# Altium schematic sheet FE_LDOs.SchDoc: FMC SDR Frontend
size 420 x 297 mm; EDA_Number: EDA-XXXXX-VX-X; Projet: -; ModifiedBy: -; CreateDate: XX/XX/XXXX; CheckedDate: -; Title2: Power Supply LDOs; DivGrp: TE/MPE; Designer: Designer
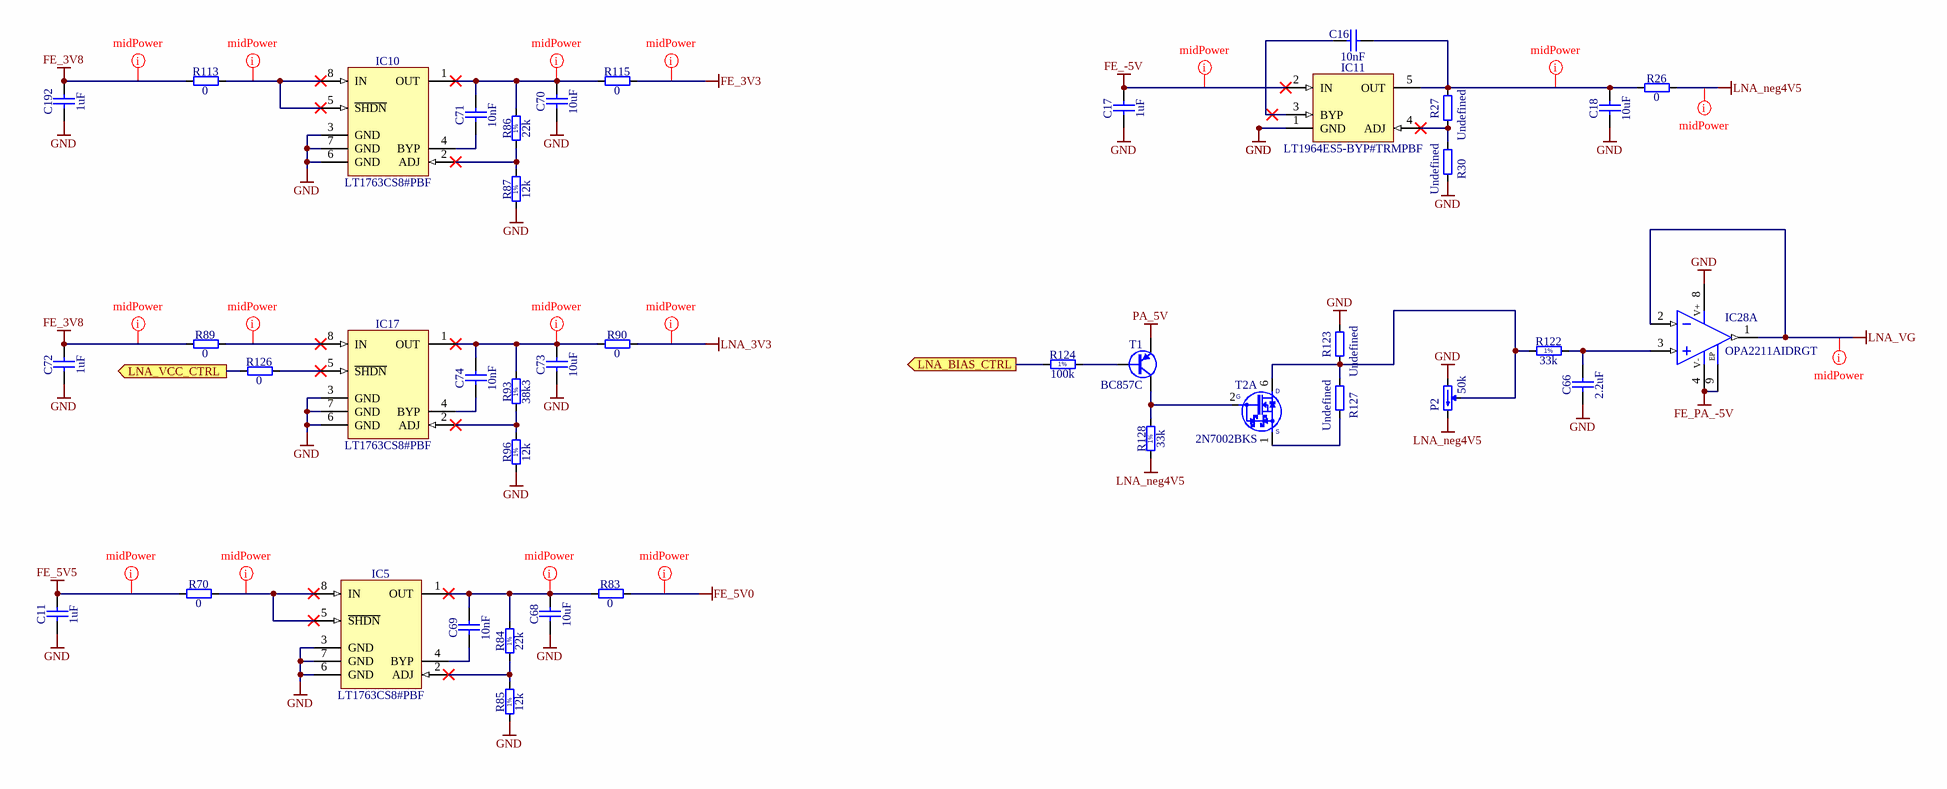
[diagram p0: FE_LDOs.SchDoc]

## Parts
C11  1uF  [CAPC1608X87N]
C16  10nF  [CAPC1608X87N]
C17  1uF  [CAPC1608X87N]
C18  10uF  [CAPC2012X95N]
C66  2.2uF  [CAPC2012X135N]
C68  10uF  [CAPC2012X95N]
C69  10nF  [CAPC1005X55N]
C70  10uF  [CAPC2012X95N]
C71  10nF  [CAPC1005X55N]
C72  1uF  [CAPC1608X87N]
C73  10uF  [CAPC2012X95N]
C74  10nF  [CAPC1005X55N]
C192  1uF  [CAPC1608X87N]
IC5  LT1763CS8#PBF  [SOIC127P600X175-8N]
IC10  LT1763CS8#PBF  [SOIC127P600X175-8N]
IC11  LT1964ES5-BYP#TRMPBF  [SOT95P280X100-5N]
IC17  LT1763CS8#PBF  [SOIC127P600X175-8N]
IC28  OPA2211AIDRGT  [SON50P300X300X80-9N-R155X250]  (part A of 2)
P2  50k  [TRIM_BOURNS_3223W]
R26  0  [RESC1608X55N]
R27  Undefined  [RESC1608X55N]
R30  Undefined  [RESC1608X55N]
R70  0  [RESC1608X55N]
R83  0  [RESC1608X55N]
R84  22k  [RESC1005X40N]
R85  12k  [RESC1005X40N]
R86  22k  [RESC1005X40N]
R87  12k  [RESC1005X40N]
R89  0  [RESC1608X55N]
R90  0  [RESC1608X55N]
R93  38k3  [RESC1005X40N]
R96  12k  [RESC1005X40N]
R113  0  [RESC1608X55N]
R115  0  [RESC1608X55N]
R122  33k  [RESC1005X40N]
R123  Undefined  [RESC1608X55N]
R124  100k  [RESC1608X55N]
R126  0  [RESC1608X55N]
R127  Undefined  [RESC1608X55N]
R128  33k  [RESC1608X55N]
T1  BC857C  [SOT95P240X110-3N]
T2  2N7002BKS  [SOT65P210X110-6N]  (part A of 2)

## Ports
LNA_BIAS_CTRL (out), LNA_VCC_CTRL (out)

## Nets
FE_3V3: R115.2
FE_3V8: C72.2 C192.2 R89.1 R113.1
FE_5V0: R83.2
FE_5V5: C11.2 R70.1
FE_-5V: C17.2 IC11.2(IN)
FE_PA_-5V: IC28.4(V-) IC28.9(Exposed_Pad)
GND: C11.1 C17.1 C18.1 C66.1 C68.1 C70.1 C72.1 C73.1 C192.1 IC5.3(GND) IC5.6(GND) IC5.7(GND) IC10.3(GND) IC10.6(GND) IC10.7(GND) IC11.1(GND) IC17.3(GND) IC17.6(GND) IC17.7(GND) IC28.8(V+) P2.1(CCW) R30.1 R85.1 R87.1 R96.1 R123.2
LNA_3V3: R90.2
LNA_neg4V5: P2.3(CW) R26.2 R128.1
LNA_VG: IC28.1(OUT) IC28.2(IN-)
PA_5V: T1.2(E)
LNA_BIAS_CTRL: R124.1 ; port LNA_BIAS_CTRL
LNA_VCC_CTRL: R126.1 ; port LNA_VCC_CTRL
NetC16_1: C16.1 IC11.3(BYP)
NetC16_2: C16.2 C18.2 IC11.5(OUT) R26.1 R27.2
NetC66_2: C66.2 IC28.3(IN+) R122.2
NetC68_2: C68.2 C69.2 IC5.1(OUT) R83.1 R84.2
NetC69_1: C69.1 IC5.4(BYP)
NetC70_2: C70.2 C71.2 IC10.1(OUT) R86.2 R115.1
NetC71_1: C71.1 IC10.4(BYP)
NetC73_2: C73.2 C74.2 IC17.1(OUT) R90.1 R93.2
NetC74_1: C74.1 IC17.4(BYP)
NetIC5_2: IC5.2(ADJ) R84.1 R85.2
NetIC5_5: IC5.5(~{SHDN}) IC5.8(IN) R70.2
NetIC10_2: IC10.2(ADJ) R86.1 R87.2
NetIC10_5: IC10.5(~{SHDN}) IC10.8(IN) R113.2
NetIC11_4: IC11.4(ADJ) R27.1 R30.2
NetIC17_2: IC17.2(ADJ) R93.1 R96.2
NetIC17_5: IC17.5(~{SHDN}) R126.2
NetIC17_8: IC17.8(IN) R89.2
NetP2_2: P2.2(W) R122.1 R123.1 R127.2 T2.6(D)
NetR124_2: R124.2 T1.1(B)
NetR127_1: R127.1 T2.1(S)
NetR128_2: R128.2 T1.3(C) T2.2(G)

## Layout directives
net class midPower: FE_3V3, FE_3V8, FE_5V0, FE_5V5, FE_-5V, LNA_3V3, LNA_neg4V5, LNA_VG, NetC16_2, NetC68_2, NetC70_2, NetC73_2, NetIC5_5, NetIC10_5, NetIC17_8

## Notes on the sheet
- (near R26) Starting from -4.5V
- Project/Equipment
- Document
- Designer
- Drawn by
- Check.by
- File
- Last Mod.
- Print Date
- Sheet
- Size
- A3
- of
- Rev
- (in symbol OPA2211AIDRGT, part A) EP
- (in symbol R0402_12K_1%_0.0625W_100PPM) 1%
- (in symbol R0402_22K_1%_0.0625W_100PPM) 1%
- (in symbol R0402_33K_1%_0.0625W_100PPM) 1%
- (in symbol R0402_38K3_1%_0.0625W_100PPM) 1%
- (in symbol R0603_33K_1%_0.1W_100PPM) 1%
- (in symbol R0603_100K_1%_0.1W_100PPM) 1%

## Library data of the parts
C11 C17 C72 C192 = CC0603_1UF_25V_10%_X7R: Non-polarised capacitor; Part Description: SMD Multilayer Chip Ceramic Capacitor; Manufacturer: GENERIC; Manufacturer1 Part Number: GRM188R71E105KA12D; Voltage: 25V; TC: X7R; Tolerance: ±10%; Part Number: CC0603_1UF_25V_10%_X7R; Component Kind: Standard; Component Type: Standard; Pin Count: 2; Value: 1uF; Status: None; Manufacturer Part Number: CC0603_1UF_25V_10%_X7R; Case: 0603; Mounted: Yes; Socket: No; SMD: Yes; Sense: No; Manufacturer1 Example: MURATA; Manufacturer1 ComponentHeight: 0.9mm; HelpURL: \\cern.ch\dfs\Applications\Altium\Datasheets\CC0603_X7R_MURATA.pdf; Author: CERN DEM JLC; CreateDate: 18/01/2011; LatestRevisionDate: 18/01/2011
C16 = CC0603_10NF_50V_5%_C0G: Non-polarised capacitor; Part Description: SMD Multilayer Chip Ceramic Capacitor; Manufacturer: GENERIC; Manufacturer1 Part Number: C1608C0G1H103J080AA; Voltage: 50V; TC: C0G/NP0; Tolerance: ±5%; Part Number: CC0603_10NF_50V_5%_C0G; Component Kind: Standard; Component Type: Standard; Pin Count: 2; Value: 10nF; Status: Preferred; Manufacturer Part Number: CC0603_10NF_50V_5%_C0G; Case: 0603; Mounted: Yes; Socket: No; SMD: Yes; Sense: No; Manufacturer1 Example: TDK; Manufacturer1 ComponentHeight: 0.9mm; HelpURL: \\cern.ch\dfs\Applications\Altium\Datasheets\CC0603_C0G_TDK_C.pdf; Author: CERN DEM JLC; CreateDate: 10.12.2014; LatestRevisionDate: 10.12.2014
C18 C68 C70 C73 = CC0805_10UF_25V_10%_X5R: Non-polarised capacitor; Part Description: SMD Multilayer Chip Ceramic Capacitor; Manufacturer: GENERIC; Manufacturer1 Part Number: GRM219R61E106KA12D; Voltage: 25V; TC: X5R; Tolerance: ±10%; Part Number: CC0805_10UF_25V_10%_X5R; Component Kind: Standard; Component Type: Standard; Pin Count: 2; Value: 10uF; Status: Preferred; Manufacturer Part Number: CC0805_10UF_25V_10%_X5R; Case: 0805; Mounted: Yes; Socket: No; SMD: Yes; Sense: No; Manufacturer1 Example: MURATA; Manufacturer1 ComponentHeight: 0.95mm; HelpURL: \\cern.ch\dfs\Applications\Altium\Datasheets\CC0805_X5R_MURATA_GRM.pdf; Author: CERN DEM JLC; CreateDate: 25/10/2012; LatestRevisionDate: 06/09/2016
C66 = CC0805_2.2UF_16V_10%_X7R: Non-polarised capacitor; Part Description: SMD Multilayer Chip Ceramic Capacitor; Manufacturer: GENERIC; Manufacturer1 Part Number: GRM21BF51C225ZA01L; Voltage: 16V; TC: X7R; Tolerance: ±10%; Part Number: CC0805_2.2UF_16V_10%_X7R; Component Kind: Standard; Component Type: Standard; Pin Count: 2; Value: 2.2uF; Status: Preferred; Manufacturer Part Number: CC0805_2.2UF_16V_10%_X7R; Case: 0805; Mounted: Yes; Socket: No; SMD: Yes; Sense: No; Manufacturer1 Example: MURATA; Manufacturer1 ComponentHeight: 1.5mm; HelpURL: \\cern.ch\dfs\Applications\Altium\Datasheets\CC0805_X7R_MURATA_GRM.pdf; Author: CERN DEM JLC; CreateDate: 03.12.2007; LatestRevisionDate: 18.09.2014
C69 C71 C74 = CC0402_10NF_50V_10%_X7R: Non-polarised capacitor; Part Description: SMD Multilayer Chip Ceramic Capacitor; Manufacturer: GENERIC; Manufacturer1 Part Number: GRM155R71H103KA88D; Voltage: 50V; TC: X7R; Tolerance: ±10%; Part Number: CC0402_10NF_50V_10%_X7R; Component Kind: Standard; Component Type: Standard; Pin Count: 2; Value: 10nF; Status: None; Manufacturer Part Number: CC0402_10NF_50V_10%_X7R; Case: 0402; Mounted: Yes; Socket: No; SMD: Yes; Sense: No; Manufacturer1 Example: MURATA; Manufacturer1 ComponentHeight: 0.55mm; HelpURL: \\cern.ch\dfs\Applications\Altium\Datasheets\CC0402_X7R_MURATA_GRM.pdf; Author: CERN DEM MR; CreateDate: 08.01.2016; LatestRevisionDate: 08.01.2016
IC5 IC10 IC17 = LT1763CS8#PBF: 1.22V to 20V 500mA, Low Noise, LDO Adjustable Micropower Regulator; Manufacturer: LINEAR TECHNOLOGY; PressFit: No; Bonding: No; Part Number: LT1763CS8#PBF; Component Kind: Standard; Component Type: Standard; Device: LT1763CS8#PBF; PackageDescription: SOIC 8, Pitch 1.27mm, Body 4x5mm, IPC Medium Density; Part Description: 1.22V to 20V 500mA, Low Noise, LDO Adjustable Micropower Regulator; Manufacturer Part Number: LT1763CS8#PBF; Pin Count: 8; Case: SOIC8; Mounted: Yes; Socket: No; SMD: Yes; Sense: No; ComponentHeight: 1.75mm; HelpURL: \\cern.ch\dfs\Applications\Altium\Datasheets\LT1763CS8#PBF.pdf; Author: CERN DEM JLC; CreateDate: 11.01.2010; LatestRevisionDate: 11.01.2010
IC11 = LT1964ES5-BYP#TRMPBF: 200mA, Low Noise, Low Dropout Negative Micropower Regulator; Part Description: -1.22V to -20V, 200mA, Low Noise, Low Dropout Negative Micropower Regulator; Manufacturer: LINEAR TECHNOLOGY; PressFit: No; Bonding: No; Part Number: LT1964ES5-BYP#TRMPBF; Component Kind: Standard; Component Type: Standard; Device: LT1964ES5-BYP#TRMPBF; PackageDescription: SOT23, 0.95mm pitch; 5 pin, 1.75mm W X 3.00mm L, IPC Medium Density; Manufacturer Part Number: LT1964ES5-BYP#TRMPBF; Pin Count: 5; Case: SOT23-5; Mounted: Yes; Socket: No; SMD: Yes; Sense: No; ComponentHeight: 1mm; HelpURL: \\cern.ch\dfs\Applications\Altium\Datasheets\LT1964ES5-BYP#TRMPBF.pdf; Author: CERN DEM MR; CreateDate: 17.02.2016; LatestRevisionDate: 17.02.2016
IC28 = OPA2211AIDRGT: Dual Operational Amplifier With Exposed Pad; Part Description: 1.1nV/sqrt Hz Noise, Low Power, PrecisionOperational Amplifier; Manufacturer: TEXAS INSTRUMENTS; PressFit: No; Bonding: No; Part Number: OPA2211AIDRGT; Component Kind: Standard; Component Type: Standard; Device: OPA2211AIDRGT; PackageDescription: SON,  0.50mm Pitch, 8 Pin, 3mm X 3mm X 0.8mm H Body (w/Thermal Tab 1.55 X 2.5mm),  IPC Medium Density; Manufacturer Part Number: OPA2211AIDRGT; Pin Count: 9; Case: SON8; Mounted: Yes; Socket: No; SMD: Yes; Sense: No; ComponentHeight: 0.8mm; Author: CERN DEM JLC; HelpURL: \\cern.ch\dfs\Applications\Altium\Datasheets\OPA2211AIDRGT.pdf; CreateDate: 17.11.2014; LatestRevisionDate: 17.11.2014
P2 = TRIM_11T_50K_BOURNS_3223W-1-503E: Trimming Potentiometer; Part Description: 11 Turns SMD Trimpot® Trimming Potentiometer (Top Adjust); Manufacturer: BOURNS; Power: 0.125W; TC: ±100ppm/°C; Tolerance: ±20%; PressFit: No; Part Number: TRIM_11T_50K_BOURNS_3223W-1-503E; Component Kind: Standard; Component Type: Standard; Pin Count: 3; Value: 50k; Manufacturer Part Number: 3223W-1-503E; Case: 3223W; Mounted: Yes; Socket: No; SMD: Yes; Sense: No; ComponentHeight: 4.16mm; HelpURL: \\cern.ch\dfs\Applications\Altium\Datasheets\TRIM_BOURNS_3223W.pdf; Author: CERN DEM JLC; CreateDate: 31.03.2011; LatestRevisionDate: 18.12.2012
R26 R70 R83 R89 R90 R113 R115 R126 = R0603_0R_JUMPER: Resistor; Part Description: 1A (0.05R Max DC Resistance) Zero Ohm Jumper; Manufacturer: GENERIC; Manufacturer1 Part Number: NRC06Z0; PressFit: No; Part Number: R0603_0R_JUMPER; Component Kind: Standard; Component Type: Standard; Pin Count: 2; Value: 0; Status: Preferred; Manufacturer Part Number: R0603_0R_JUMPER; Case: 0603; Mounted: Yes; Sense: No; Socket: No; SMD: Yes; Manufacturer1 Example: NIC COMPONENT; Manufacturer1 ComponentHeight: 0.55mm; HelpURL: \\cern.ch\dfs\Applications\Altium\Datasheets\R0603_NIC_NRC.pdf; Author: CERN DEM JLC; CreateDate: 03.12.2007; LatestRevisionDate: 13.03.2008
R27 R30 R123 R127 = R0603_NO-VALUE: Resistor; Part Description: Reserved Footprint For a 0603 (1608) Chip Resistor; PressFit: No; Mounted: No; Part Number: R0603_NO-VALUE; Component Kind: Standard; Component Type: Standard; Pin Count: 2; Value: Undefined; Status: None; Manufacturer: Undefined; Manufacturer Part Number: R0603_NO-VALUE; Case: 0603; Sense: No; Socket: No; SMD: Yes; Manufacturer1 Example: Undefined; Manufacturer1 Part Number: Undefined; Manufacturer1 ComponentHeight: Undefined; HelpURL: Undefined; Author: CERN DEM JLC; CreateDate: 03.12.2007; LatestRevisionDate: 13.03.2008
R84 R86 = R0402_22K_1%_0.0625W_100PPM: Resistor - 1%; Part Description: General Purpose Thick Film Chip Resistor; Manufacturer: GENERIC; Manufacturer1 Part Number: 232270672203L; TC: ±100ppm/°C; PressFit: No; Part Number: R0402_22K_1%_0.0625W_100PPM; Component Kind: Standard; Component Type: Standard; Pin Count: 2; Value: 22k; Status: Not Recommended; Power: 0.0625W; Tolerance: ±1%; Manufacturer Part Number: R0402_22K_1%_0.0625W_100PPM; Case: 0402; Mounted: Yes; Sense: No; Socket: No; SMD: Yes; Manufacturer1 Example: YAGEO PHYCOMP; Manufacturer1 ComponentHeight: 0.4mm; HelpURL: \\cern.ch\dfs\Applications\Altium\Datasheets\R0402_Phycomp_RC0402.pdf; Author: CERN DEM JLC; CreateDate: 03.12.2007; LatestRevisionDate: 17.10.2012
R85 R87 R96 = R0402_12K_1%_0.0625W_100PPM: Resistor - 1%; Part Description: General Purpose Thick Film Chip Resistor; Manufacturer: GENERIC; Manufacturer1 Part Number: 232270671203L; TC: ±100ppm/°C; PressFit: No; Part Number: R0402_12K_1%_0.0625W_100PPM; Component Kind: Standard; Component Type: Standard; Pin Count: 2; Value: 12k; Status: Not Recommended; Power: 0.0625W; Tolerance: ±1%; Manufacturer Part Number: R0402_12K_1%_0.0625W_100PPM; Case: 0402; Mounted: Yes; Sense: No; Socket: No; SMD: Yes; Manufacturer1 Example: YAGEO PHYCOMP; Manufacturer1 ComponentHeight: 0.4mm; HelpURL: \\cern.ch\dfs\Applications\Altium\Datasheets\R0402_Phycomp_RC0402.pdf; Author: CERN DEM JLC; CreateDate: 03.12.2007; LatestRevisionDate: 17.10.2012
R93 = R0402_38K3_1%_0.0625W_100PPM: Resistor - 1%; Part Description: General Purpose Thick Film Chip Resistor; Manufacturer: GENERIC; Manufacturer1 Part Number: 232270673833L or RC0402FR-0738K3L; TC: ±100ppm/°C; PressFit: No; Part Number: R0402_38K3_1%_0.0625W_100PPM; Component Kind: Standard; Component Type: Standard; Pin Count: 2; Value: 38k3; Status: Not Recommended; Power: 0.0625W; Tolerance: ±1%; Manufacturer Part Number: R0402_38K3_1%_0.0625W_100PPM; Case: 0402; Mounted: Yes; Sense: No; Socket: No; SMD: Yes; Manufacturer1 Example: YAGEO PHYCOMP; Manufacturer1 ComponentHeight: 0.4mm; HelpURL: \\cern.ch\dfs\Applications\Altium\Datasheets\R0402_Phycomp_RC0402.pdf; Author: CERN DEM BC; CreateDate: 29.07.2015; LatestRevisionDate: 29.07.2015
R122 = R0402_33K_1%_0.0625W_100PPM: Resistor - 1%; Part Description: General Purpose Thick Film Chip Resistor; Manufacturer: GENERIC; Manufacturer1 Part Number: 232270673303L; TC: ±100ppm/°C; PressFit: No; Part Number: R0402_33K_1%_0.0625W_100PPM; Component Kind: Standard; Component Type: Standard; Pin Count: 2; Value: 33k; Status: Not Recommended; Power: 0.0625W; Tolerance: ±1%; Manufacturer Part Number: R0402_33K_1%_0.0625W_100PPM; Case: 0402; Mounted: Yes; Sense: No; Socket: No; SMD: Yes; Manufacturer1 Example: YAGEO PHYCOMP; Manufacturer1 ComponentHeight: 0.4mm; HelpURL: \\cern.ch\dfs\Applications\Altium\Datasheets\R0402_Phycomp_RC0402.pdf; Author: CERN DEM JLC; CreateDate: 03.12.2007; LatestRevisionDate: 17.10.2012
R124 = R0603_100K_1%_0.1W_100PPM: Resistor - 1%; Part Description: General Purpose Thick Film Chip Resistor; Manufacturer: GENERIC; Manufacturer1 Part Number: NRC06F1003TRF; Power: 0.1W; TC: ±100ppm/°C; PressFit: No; Part Number: R0603_100K_1%_0.1W_100PPM; Component Kind: Standard; Component Type: Standard; Pin Count: 2; Value: 100k; Status: Preferred; Tolerance: ±1%; Manufacturer Part Number: R0603_100K_1%_0.1W_100PPM; Case: 0603; Mounted: Yes; Sense: No; Socket: No; SMD: Yes; Manufacturer1 Example: NIC COMPONENT; Manufacturer1 ComponentHeight: 0.55mm; HelpURL: \\cern.ch\dfs\Applications\Altium\Datasheets\R0603_NIC_NRC.pdf; Author: CERN DEM JLC; CreateDate: 03.12.2007; LatestRevisionDate: 13.03.2008
R128 = R0603_33K_1%_0.1W_100PPM: Resistor - 1%; Part Description: General Purpose Thick Film Chip Resistor; Manufacturer: GENERIC; Manufacturer1 Part Number: NRC06F3302TRF; Power: 0.1W; TC: ±100ppm/°C; PressFit: No; Part Number: R0603_33K_1%_0.1W_100PPM; Component Kind: Standard; Component Type: Standard; Pin Count: 2; Value: 33k; Status: Preferred; Tolerance: ±1%; Manufacturer Part Number: R0603_33K_1%_0.1W_100PPM; Case: 0603; Mounted: Yes; Sense: No; Socket: No; SMD: Yes; Manufacturer1 Example: NIC COMPONENT; Manufacturer1 ComponentHeight: 0.55mm; HelpURL: \\cern.ch\dfs\Applications\Altium\Datasheets\R0603_NIC_NRC.pdf; Author: CERN DEM JLC; CreateDate: 03.12.2007; LatestRevisionDate: 13.03.2008
T1 = BC857C: PNP Transistor; Part Description: 45V 100mA PNP  Silicon AF Transistor; Manufacturer: INFINEON; PressFit: No; Bonding: No; Part Number: BC857C; Component Kind: Standard; Component Type: Standard; Device: BC857C; PackageDescription: SOT23 3-Leads, Pitch 0.95mm - Body 1.3x2.9mm, IPC Medium Density; Manufacturer Part Number: BC857C; Pin Count: 3; Case: SOT23-3; Mounted: Yes; Socket: No; SMD: Yes; Sense: No; ComponentHeight: 1.1mm; HelpURL: \\cern.ch\dfs\Applications\Altium\Datasheets\BC857C.pdf; Author: CERN DEM JLC; CreateDate: 23.09.2014; LatestRevisionDate: 23.09.2014
T2 = 2N7002BKS: 60V, 300mA Dual N-Channel Trench MOSFET; Manufacturer: NXP SEMICONDUCTORS; Manufacturer Part Number: 2N7002BKS6; PressFit: No; Bonding: No; Part Number: 2N7002BKS; Component Kind: Standard; Component Type: Standard; Device: 2N7002BKS; PackageDescription: SOT363, SC70-6, SOT, 0.65mm Pitch, 6 pin, 1.25mm W X 2.00mm L X 1.10mm H, IPC Medium Density; Part Description: 60 V, 300 mA Dual N-Channel Trench MOSFET; Pin Count: 4; Case: SOT363; Mounted: Yes; Socket: No; SMD: Yes; Sense: No; ComponentHeight: 1.1mm; HelpURL: \\cern.ch\dfs\Applications\Altium\Datasheets\2N7002BKS.pdf; Author: CERN DEM JLC; CreateDate: 27.11.2012; LatestRevisionDate: 27.11.2012